# Altium schematic sheet fft.SchDoc
size A4
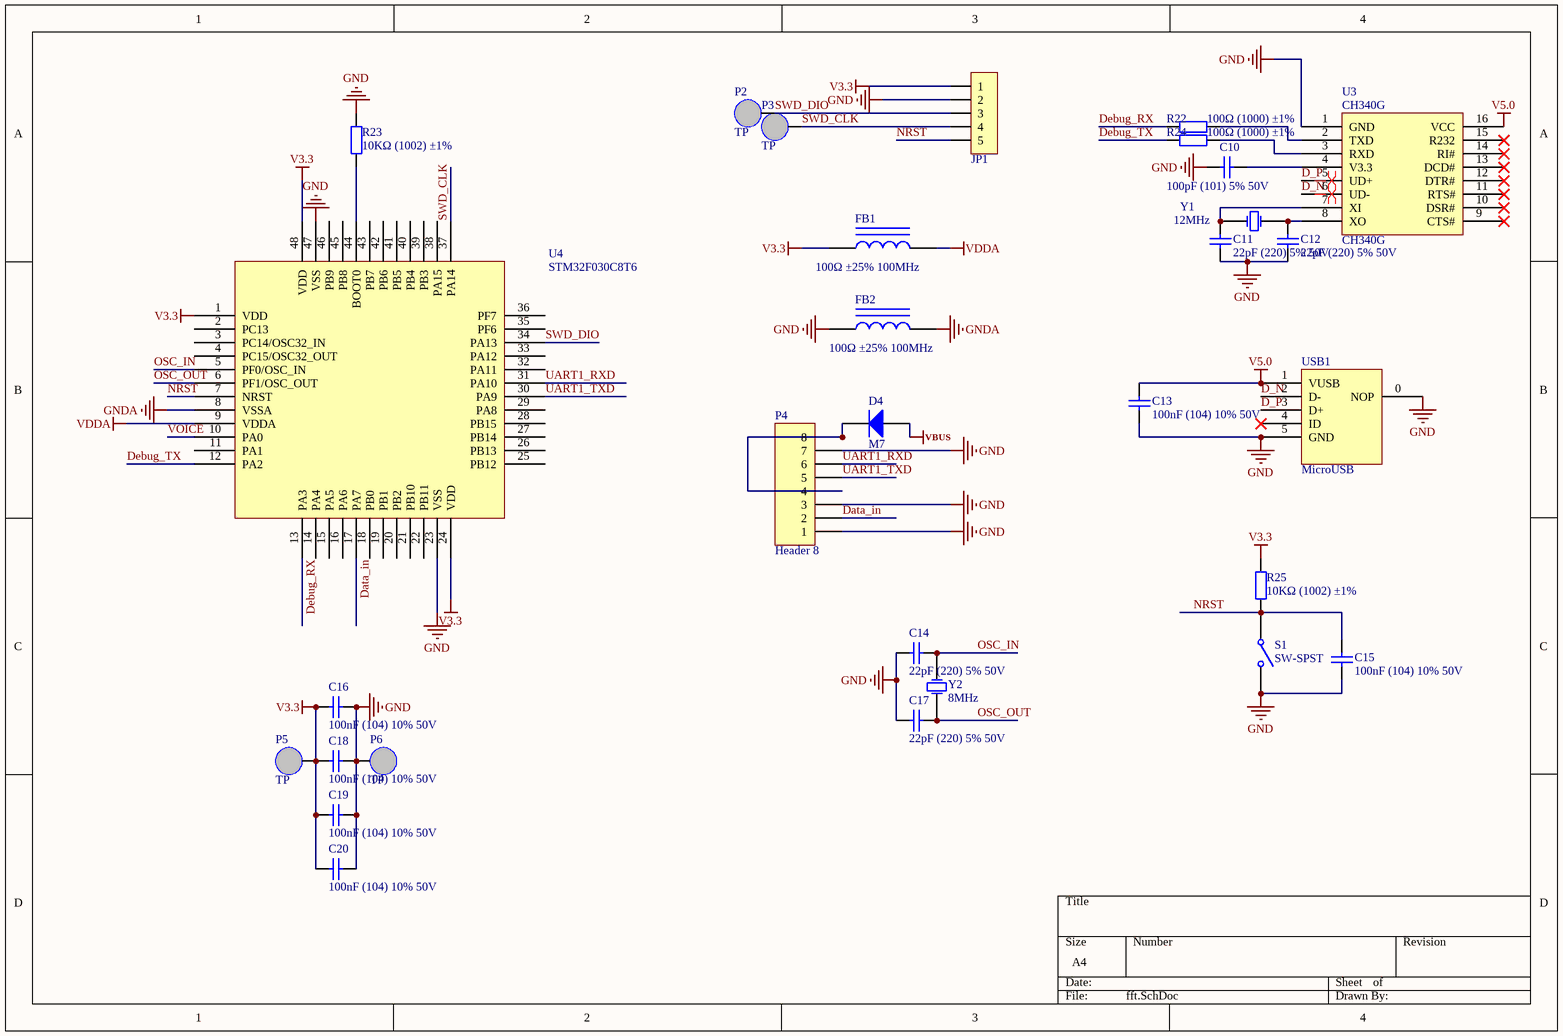
[diagram p0: fft.SchDoc]

## Parts
C10  100pF (101) 5% 50V  [0805_C]
C11  22pF (220) 5% 50V  [0805_C]
C12  22pF (220) 5% 50V  [0805_C]
C13  100nF (104) 10% 50V  [0603_C]
C14  22pF (220) 5% 50V  [0805_C]
C15  100nF (104) 10% 50V  [0603_C]
C16  100nF (104) 10% 50V  [0603_C]
C17  22pF (220) 5% 50V  [0805_C]
C18  100nF (104) 10% 50V  [0603_C]
C19  100nF (104) 10% 50V  [0603_C]
C20  100nF (104) 10% 50V  [0603_C]
D4  M7  [SMA(DO-214AC)_S1]
FB1  100Ω ±25% 100MHz  [0805_L]
FB2  100Ω ±25% 100MHz  [0805_L]
JP1  HDR-1X5  [XH2.54-LI-5P]  (value not drawn)
P2  TP  [TP]
P3  TP  [TP]
P4  Header 8  [FPC1.0-2H-WS-8P]
P5  TP  [TP]
P6  TP  [TP]
R22  100Ω (1000) ±1%  [0603_R]
R23  10KΩ (1002) ±1%  [0603_R]
R24  100Ω (1000) ±1%  [0603_R]
R25  10KΩ (1002) ±1%  [0805_R]
S1  SW-SPST  [TSW SMD-3*6*2.5]
U3  CH340G  [SOIC-16_150mil]
U4  STM32F030C8T6  [LQFP-48_7x7x05P]
USB1  MicroUSB  [MicroUSB]
Y1  12MHz  [Y]
Y2  8MHz  [SMD-5032_2P]

## Nets
GND: C10.1 C11.2 C12.2 C13.1 C14.2 C15.1 C16.2 C17.2 C18.2 C19.2 C20.2 FB2.1 JP1.2 P4.1 P4.3 P4.7 P6.1 R23.2 S1.2(NO) U3.1(GND) U4.23(VSS) U4.47(VSS) USB1.0(NOP) USB1.5(GND)
GNDA: FB2.2 U4.8(VSSA)
V3.3: C16.1 C18.1 C19.1 C20.1 FB1.1 JP1.1 P5.1 R25.2 U4.1(VDD) U4.24(VDD) U4.48(VDD)
V5.0: C13.2 U3.16(VCC) USB1.1(VUSB)
VBUS: D4.1(A)
VDDA: FB1.2 U4.9(VDDA)
D_N: U3.6(UD-) USB1.2(D-)
D_P: U3.5(UD+) USB1.3(D+)
Data_in: P4.2 U4.17(PA7)
Debug_RX: R22.1 U4.13(PA3)
Debug_TX: R24.1 U4.12(PA2)
NRST: C15.2 JP1.5 R25.1 S1.1(COMMON) U4.7(NRST)
OSC_IN: C14.1 U4.5(PF0/OSC_IN) Y2.1(OSC1)
OSC_OUT: C17.1 U4.6(PF1/OSC_OUT) Y2.2(OSC2)
SWD_CLK: JP1.4 P3.1 U4.37(PA14)
SWD_DIO: JP1.3 P2.1 U4.34(PA13)
UART1_RXD: P4.6 U4.31(PA10)
UART1_TXD: P4.5 U4.30(PA9)
VOICE: U4.10(PA0)
NetC10_2: C10.2 U3.4(V3.3)
NetC11_1: C11.1 U3.7(XI) Y1.1(OSC1)
NetC12_1: C12.1 U3.8(XO) Y1.2(OSC2)
NetD4_2: D4.2(K) P4.4 P4.8
NetR22_2: R22.2 U3.2(TXD)
NetR23_1: R23.1 U4.44(BOOT0)
NetR24_2: R24.2 U3.3(RXD)

Not connected (* = marked no-connect by the designer): U3 9(CTS#)* 10(DSR#)* 11(RTS#)* 12(DTR#)* 13(DCD#)* 14(RI#)* 15(R232)*; U4 2(PC13) 3(PC14/OSC32_IN) 4(PC15/OSC32_OUT) 11(PA1) 14(PA4) 15(PA5) 16(PA6) 18(PB0) 19(PB1) 20(PB2) 21(PB10) 22(PB11) 25(PB12) 26(PB13) 27(PB14) 28(PB15) 29(PA8) 32(PA11) 33(PA12) 35(PF6) 36(PF7) 38(PA15) 39(PB3) 40(PB4) 41(PB5) 42(PB6) 43(PB7) 45(PB8) 46(PB9); USB1 4(ID)*

## Layout directives
differential pair: (no net found under the mark)

## Library data of the parts
C10 = 0805 100pF (101) 5% 50V: 贴片电容; ComponentLink1Description: 供应商链接; ComponentLink1URL: http://www.szlcsc.com/product/details_2142.html; Package: 0805; Supplier: LC; SuppliersPartNumber: C1790
C11 C12 C14 C17 = 0805 22pF (220) 5% 50V: 贴片电容; ComponentLink1Description: 供应商链接; ComponentLink1URL: http://www.szlcsc.com/product/details_2156.html; Package: 0805; Supplier: LC; SuppliersPartNumber: C1804
C13 C15 C16 C18-C20 = 0603 100nF (104) 10% 50V: 贴片电容; ComponentLink1Description: 供应商链接; ComponentLink1URL: http://www.szlcsc.com/product/details_15331.html; Package: 0603; Supplier: LC; SuppliersPartNumber: C14663
D4 = SMA(DO-214AC) M7: 二极管; 备注: 1N4007 4007 编号C2464 已经停售, 使用新物料编号C95872; ComponentLink1Description: 供应商链接; ComponentLink1URL: http://www.szlcsc.com/product/details_2841.html; Package: SMA(DO-214AC); Supplier: LC; SuppliersPartNumber: C95872
FB1 FB2 = 0805 100Ω 25% 100MHz: 贴片磁珠; ComponentLink1Description: 供应商链接; ComponentLink1URL: http://www.szlcsc.com/product/details_1367.html; Package: 0805; Supplier: LC; SuppliersPartNumber: C1015
JP1 = Header 5: 5P接插件; 版权归属: 源创客; BOM名称: 5P接插件; 学习资源: www.ooocke.com
P4 = Header 8: Header, 8-Pin; LatestRevisionDate: 17-Jul-2002; LatestRevisionNote: Re-released for DXP Platform.; Publisher: Altium Limited
R22 R24 = 0603 100Ω (1000) 1%: 贴片电阻; ComponentLink1Description: 供应商链接; ComponentLink1URL: http://www.szlcsc.com/product/details_23502.html; Package: 0603; Supplier: LC; SuppliersPartNumber: C22775
R23 = 0603 10KΩ (1002) 1%: 贴片电阻; ComponentLink1Description: 供应商链接; ComponentLink1URL: http://www.szlcsc.com/product/details_26547.html; Package: 0603; Supplier: LC; SuppliersPartNumber: C25804
R25 = 0805 10KΩ (1002) 1%: 贴片电阻; ComponentLink1Description: 供应商链接; ComponentLink1URL: http://www.szlcsc.com/product/details_18102.html; Package: 0805; Supplier: LC; SuppliersPartNumber: C17414
S1 = SW-SPST: Single-Pole, Single-Throw Switch; Published: 24-Mar-1999; LatestRevisionDate: 17-Jul-2002; LatestRevisionNote: Re-released for DXP Platform.; PackageReference: SPST-2; Publisher: Altium Limited; PackageDescription: Switch; 2 Leads
U3 = CH340G_[C14267]: USB; ComponentLink1Description: 供应商链接; ComponentLink1URL: http://www.szlcsc.com/product/details_14927.html; Package: SOIC-16_150mil; Supplier: LC; SuppliersPartNumber: C14267
U4 = STM32F030C8T6: ARM; ComponentLink1Description: 供应商链接; ComponentLink1URL: http://www.szlcsc.com/product/details_24662.html; Package: LQFP-48_7x7x05P; Supplier: LC; SuppliersPartNumber: C23922
Y1 Y2 = SMD-5032_2P 8MHz 20ppm 20pF: 贴片晶振; ComponentLink1Description: 供应商链接; ComponentLink1URL: http://www.szlcsc.com/product/details_117214.html; Package: SMD-5032_2P; Supplier: LC; SuppliersPartNumber: C115962